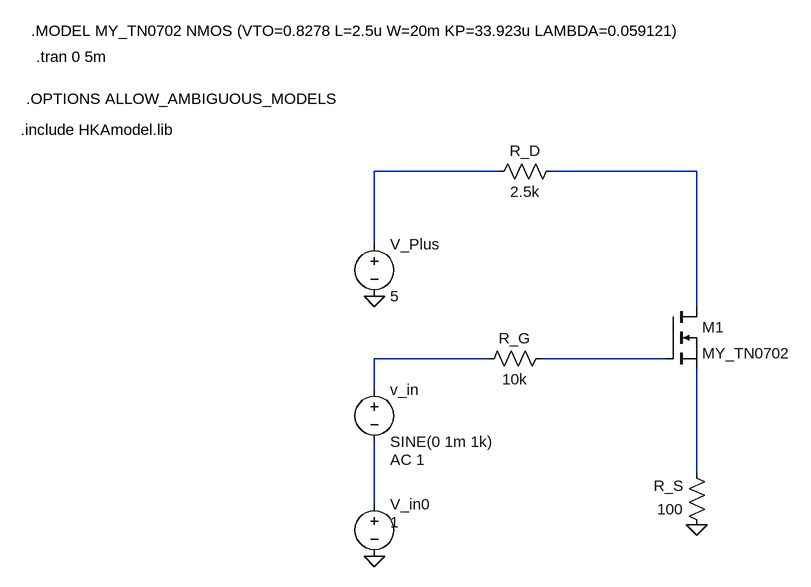
[diagram p0: schematic 1_3.asc]
1_3.asc, the LTspice schematic file:
Version 4.1
SHEET 1 880 680
WIRE 48 -48 -144 -48
WIRE 352 -48 128 -48
WIRE -144 64 -144 -48
WIRE 352 160 352 -48
WIRE 32 240 -144 240
WIRE 304 240 112 240
WIRE -144 288 -144 240
WIRE 352 416 352 256
WIRE -144 464 -144 368
FLAG -144 144 0
FLAG -144 544 0
FLAG 352 496 0
SYMBOL voltage -144 48 R0
SYMATTR InstName V_Plus
SYMATTR Value 5
SYMBOL voltage -144 272 R0
WINDOW 123 24 124 Left 2
WINDOW 39 0 0 Left 0
SYMATTR InstName v_in
SYMATTR Value SINE(0 1m 1k)
SYMATTR Value2 AC 1
SYMBOL voltage -144 448 R0
WINDOW 3 24 44 Left 2
WINDOW 123 0 0 Left 0
WINDOW 39 0 0 Left 0
SYMATTR InstName V_in0
SYMATTR Value 1
SYMBOL res 128 224 R90
WINDOW 0 0 56 VBottom 2
WINDOW 3 32 56 VTop 2
SYMATTR InstName R_G
SYMATTR Value 10k
SYMBOL res 144 -64 R90
WINDOW 0 0 56 VBottom 2
WINDOW 3 32 56 VTop 2
SYMATTR InstName R_D
SYMATTR Value 2.5k
SYMBOL res 368 512 R180
WINDOW 0 36 76 Left 2
WINDOW 3 36 40 Left 2
SYMATTR InstName R_S
SYMATTR Value 100
SYMBOL nmos 304 160 R0
SYMATTR InstName M1
SYMATTR Value MY_TN0702
TEXT -688 -112 Left 2 !.include HKAmodel.lib
TEXT -680 -160 Left 2 !.OPTIONS ALLOW_AMBIGUOUS_MODELS
TEXT -672 -264 Left 2 !.MODEL MY_TN0702 NMOS (VTO=0.8278 L=2.5u W=20m KP=33.923u LAMBDA=0.059121)
TEXT -664 -224 Left 2 !.tran 0 5m

The netlist it stands for:
* 1_3.asc
V_Plus N001 0 5
v_in N003 N006 SINE(0 1m 1k) AC 1
V_in0 N006 0 1
R_G N004 N003 10k
R_D N002 N001 2.5k
R_S 0 N005 100
M1 N002 N004 N005 N005 MY_TN0702
.model NMOS NMOS
.model PMOS PMOS
.lib standard.mos
.include HKAmodel.lib
.OPTIONS ALLOW_AMBIGUOUS_MODELS
.MODEL MY_TN0702 NMOS (VTO=0.8278 L=2.5u W=20m KP=33.923u LAMBDA=0.059121)
.tran 0 5m
.backanno
.end